# EAGLE schematic Servo_tester_rev1 (EAGLE 9.5.1)
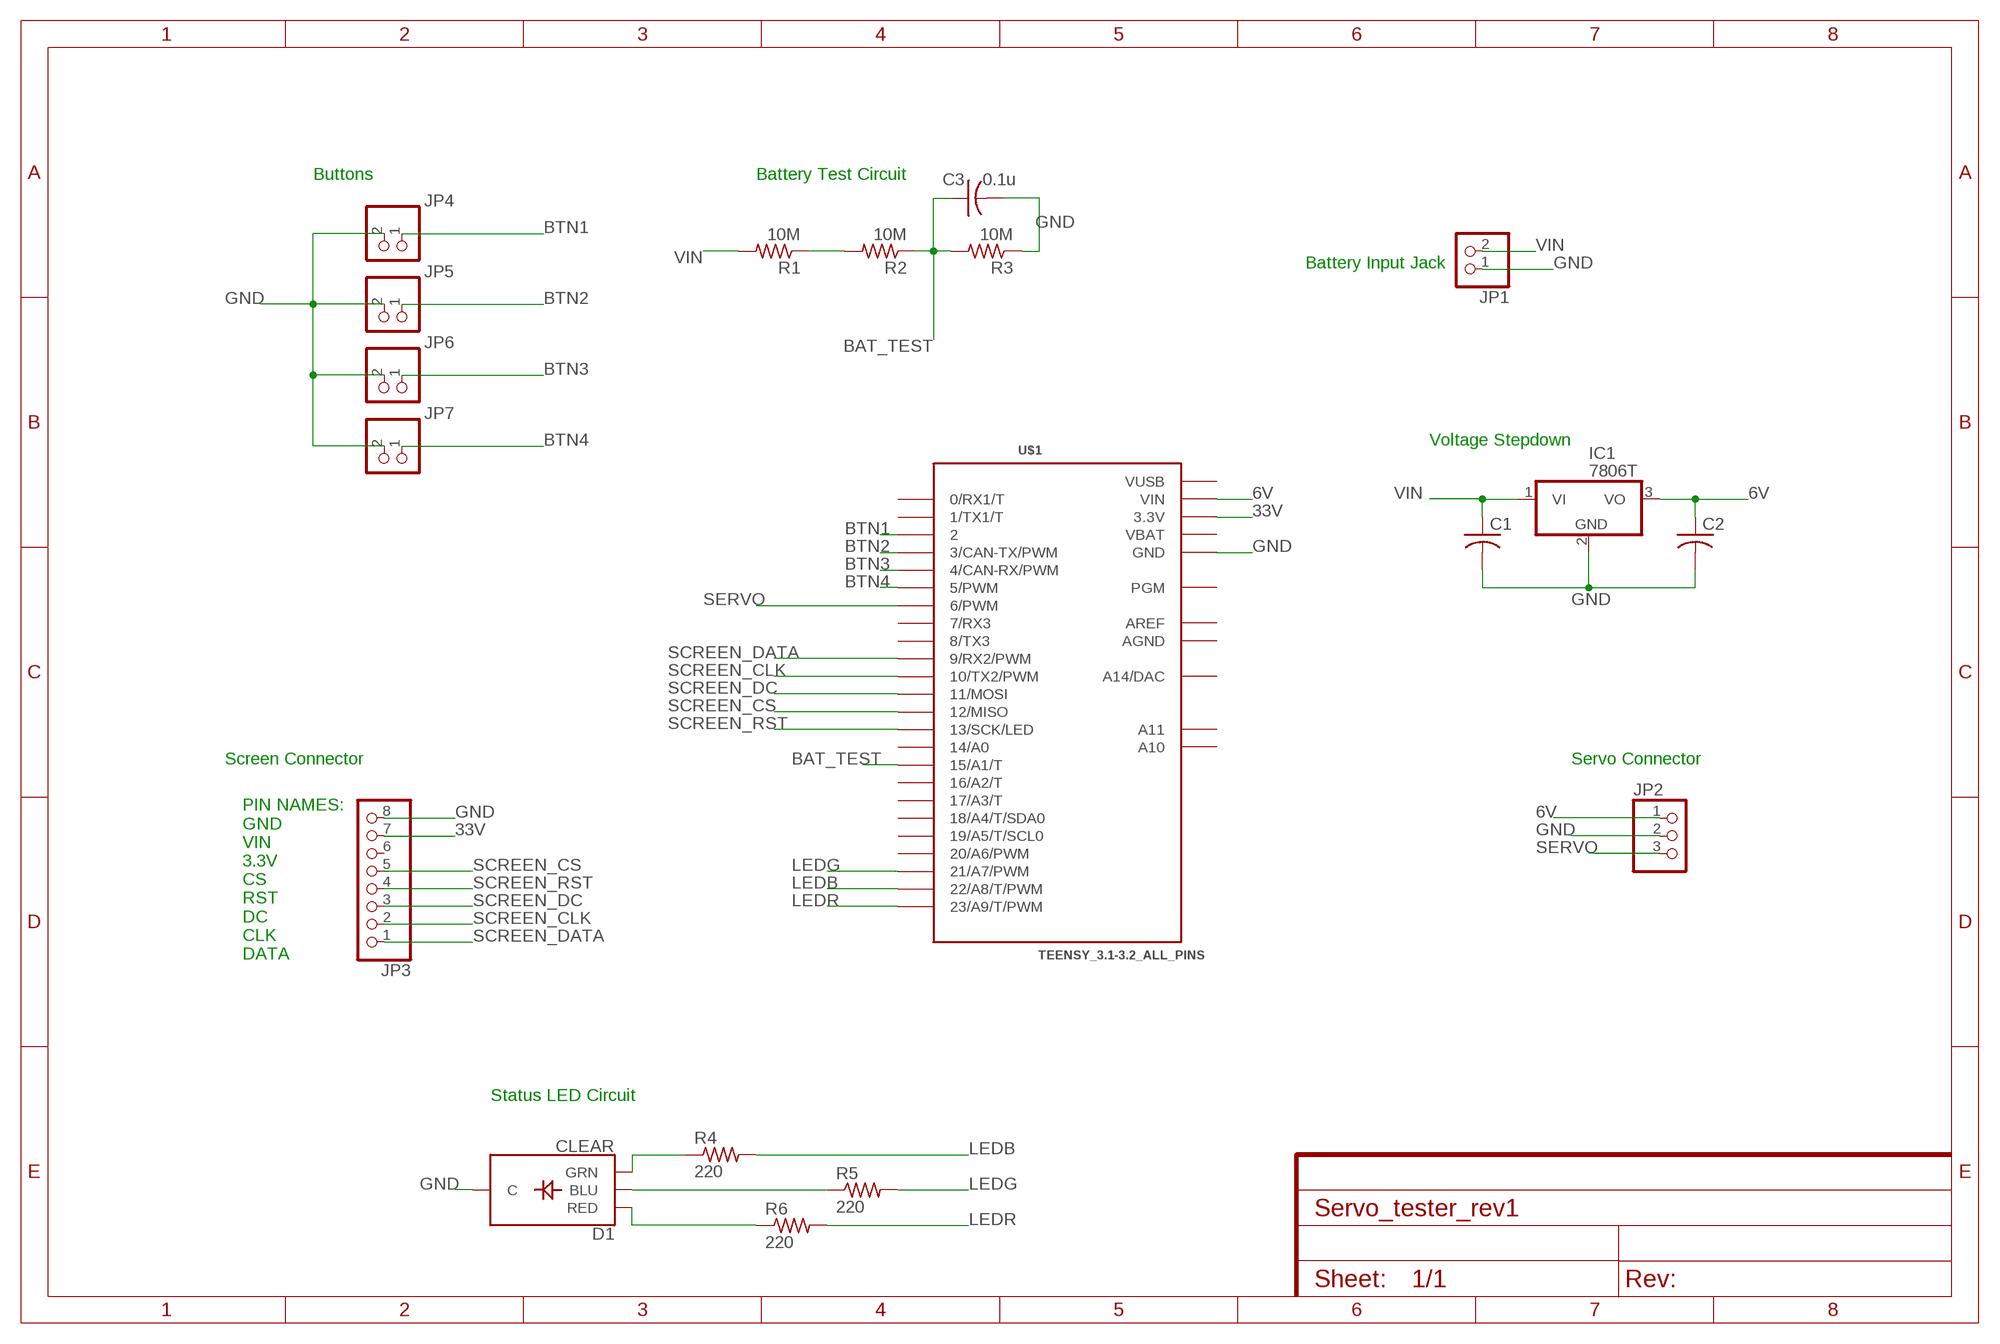
[diagram p0: schematic, sheet 1]

## Parts
C1  C-US050-024X044  [C050-024X044]
C2  C-US050-024X044  [C050-024X044]
C3  0.1u  C-US050-024X044  [C050-024X044]
D1  CLEAR  LED-RGB-CCCLEAR  [LED-RGB-THRU]
IC1  7806T  [TO220H]
JP1  HEADER-1X2ROUND  [1X02_ROUND]
JP2  HEADER-1X3ROUND  [1X03_ROUND]
JP3  HEADER-1X870MIL  [1X08_ROUND_70]
JP4  HEADER-1X2ROUND  [1X02_ROUND]
JP5  HEADER-1X2ROUND  [1X02_ROUND]
JP6  HEADER-1X2ROUND  [1X02_ROUND]
JP7  HEADER-1X2ROUND  [1X02_ROUND]
R1  10M  R-US_0204/5  [0204/5]
R2  10M  R-US_0204/5  [0204/5]
R3  10M  R-US_0204/5  [0204/5]
R4  220  R-US_0204/5  [0204/5]
R5  220  R-US_0204/5  [0204/5]
R6  220  R-US_0204/5  [0204/5]
U$1  TEENSY_3.1-3.2_ALL_PINS  [TEENSY_3.0-3.2&LC_ALL_PINS]

## Nets
6V: C2.1 IC1.3(VO) JP2.1 U$1.VIN
33V: JP3.7 U$1.3.3V U$1.3.3V1(3.3V)
BAT_TEST: C3.1 R2.1 R3.2 U$1.15/A1(15/A1/T)
BTN1: JP4.1 U$1.2
BTN2: JP5.1 U$1.3(3/CAN-TX/PWM)
BTN3: JP6.1 U$1.4(4/CAN-RX/PWM)
BTN4: JP7.1 U$1.5(5/PWM)
GND: C1.2 C2.2 C3.2 D1.2(C) IC1.2(GND) JP1.1 JP2.2 JP3.8 JP4.2 JP5.2 JP6.2 JP7.2 R3.1 U$1.GND U$1.GND1(GND)
LEDB: R4.2 U$1.22/A8(22/A8/T/PWM)
LEDG: R5.2 U$1.21/A7(21/A7/PWM)
LEDR: R6.2 U$1.23/A9(23/A9/T/PWM)
N$13: D1.1(RED) R6.1
N$14: D1.3(GRN) R4.1
N$15: D1.4(BLU) R5.1
N$19: R1.1 R2.2
SCREEN_CLK: JP3.2 U$1.10(10/TX2/PWM)
SCREEN_CS: JP3.5 U$1.12(12/MISO)
SCREEN_DATA: JP3.1 U$1.9(9/RX2/PWM)
SCREEN_DC: JP3.3 U$1.11(11/MOSI)
SCREEN_RST: JP3.4 U$1.13(13/SCK/LED)
SERVO: JP2.3 U$1.6(6/PWM)
VIN: C1.1 IC1.1(VI) JP1.2 R1.2
Unconnected: JP3.6 U$1.0(0/RX1/T) U$1.1(1/TX1/T) U$1.7(7/RX3) U$1.8(8/TX3) U$1.14/A0 U$1.16/A2(16/A2/T) U$1.17/A3(17/A3/T) U$1.18/A4(18/A4/T/SDA0) U$1.19/A5(19/A5/T/SCL0) U$1.20/A6(20/A6/PWM) U$1.A10 U$1.A11 U$1.PGM U$1.RESET/DAC(A14/DAC)

## Notes on the sheet
- Buttons | Battery Test Circuit
- Battery Input Jack
- Voltage Stepdown
- Screen Connector | Servo Connector
- PIN NAMES:
  GND
  VIN
  3.3V
  CS
  RST
  DC
  CLK
  DATA
- Status LED Circuit

## Power pins joined to a net without a drawn wire
AGND: U$1.AGND
AREF: U$1.AREF
VBAT: U$1.VBAT
VUSB: U$1.VUSB

## Library data of the parts
C1-C3 = adafruit:C-US: CAPACITOR, American symbol
D1 = SparkFun-LED:LED-RGB-CC: LED-RGB Common Cathode Packages: LED RGB-THRU LED_PIRANHA_5MM SparkFun Products: RGB Diffused Common Cathode- Diffuse <[https://www.sparkfun.com/products/9264]> RGB Diffused Common Cathode - Clear <[https://www.sparkfun.com/products/105]> LED-RGB 5mm Square (Piranha) <[https://www.sparkfun.com/products/11679]>; PROD_ID: DIO-08418
IC1 = adafruit:78*: Positive VOLTAGE REGULATOR Added bigger pads to the TO-92 package
JP1 JP4-JP7 = microbuilder:HEADER-1X2: PIN HEADER
JP2 = microbuilder:HEADER-1X3: PIN HEADER
JP3 = microbuilder:HEADER-1X8: PIN HEADER
R1-R6 = adafruit:R-US_: RESISTOR, American symbol
U$1 = Teensy_3_and_LC_Series_Boards_v1.4:TEENSY_3.1-3.2_ALL_PINS: Footprint for Teensy 3.1 or 3.2 board using all through-holes, i.e. the entire perimeter plus the 4 through-holes inboard (A10,A11,AREF, VUSB)